# EAGLE design LEDboard (EAGLE 6.2)
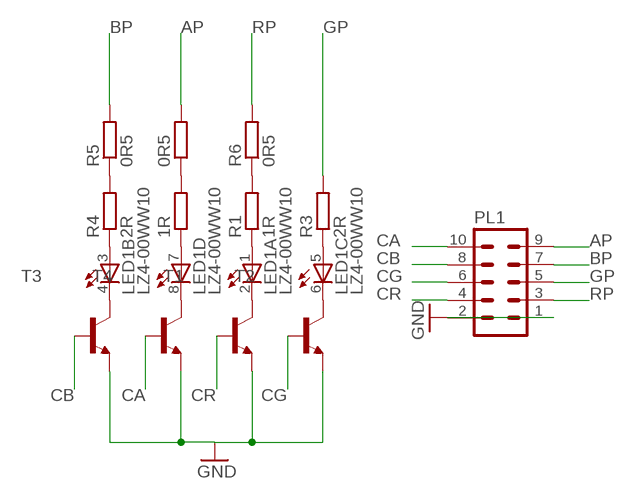
[diagram p0: schematic, sheet 1]

## Parts
0R5  R-EU_R0805  [R0805]
1R  R-EU_R1210  [R1210]
LED1  LZ4-00WW10  [LZ4-00WW10]
PL1  10V  [10V]
R1  1R  R-EU_R1210  [R1210]
R3  2R  R-EU_R2512  [R2512]
R4  2R  R-EU_R2512  [R2512]
R5  0R5  R-EU_R0805  [R0805]
R6  0R5  R-EU_R0805  [R0805]
T1  PZT2222A-NPN-SOT223  [SOT223]
T2  PZT2222A-NPN-SOT223  [SOT223]
T3  PZT2222A-NPN-SOT223  [SOT223]
T4  PZT2222A-NPN-SOT223  [SOT223]

## Nets
AP: 0R5.2 PL1.9
BP: PL1.7 R5.2
CA: PL1.10 T4.1(B)
CB: PL1.8 T3.1(B)
CG: PL1.6 T2.1(B)
CR: PL1.4 T1.1(B)
GND: PL1.1 PL1.2 T1.3(E) T2.3(E) T3.3(E) T4.3(E)
GP: PL1.5 R3.2
N$1: LED1.1(A:A) R1.1
N$2: 1R.1 LED1.7(D:A)
N$3: LED1.5(C:A) R3.1
N$4: LED1.3(B:A) R4.1
N$5: R4.2 R5.1
N$6: R1.2 R6.1
N$7: 0R5.1 1R.2
N$8: LED1.2(A:C) T1.4(C)
N$9: LED1.6(C:C) T2.4(C)
N$10: LED1.4(B:C) T3.4(C)
N$11: LED1.8(D:C) T4.4(C)
RP: PL1.3 R6.2

## Library data of the parts
0R5 1R R1 R3-R6 = resistor:R-EU_: RESISTOR, European symbol
LED1 = led1:LZ4-00WW10: High Luminous Efficacy 10W LED http://www.ledengin.com/products/10wLZ/LZ4-00WW10.pdf
PL1 = con-harting-v:10V: CONNECTOR; OC_FARNELL: unknown; OC_NEWARK: unknown
T1-T4 = transistor-neu-to92:*-NPN-: NPN Transistror

## Board
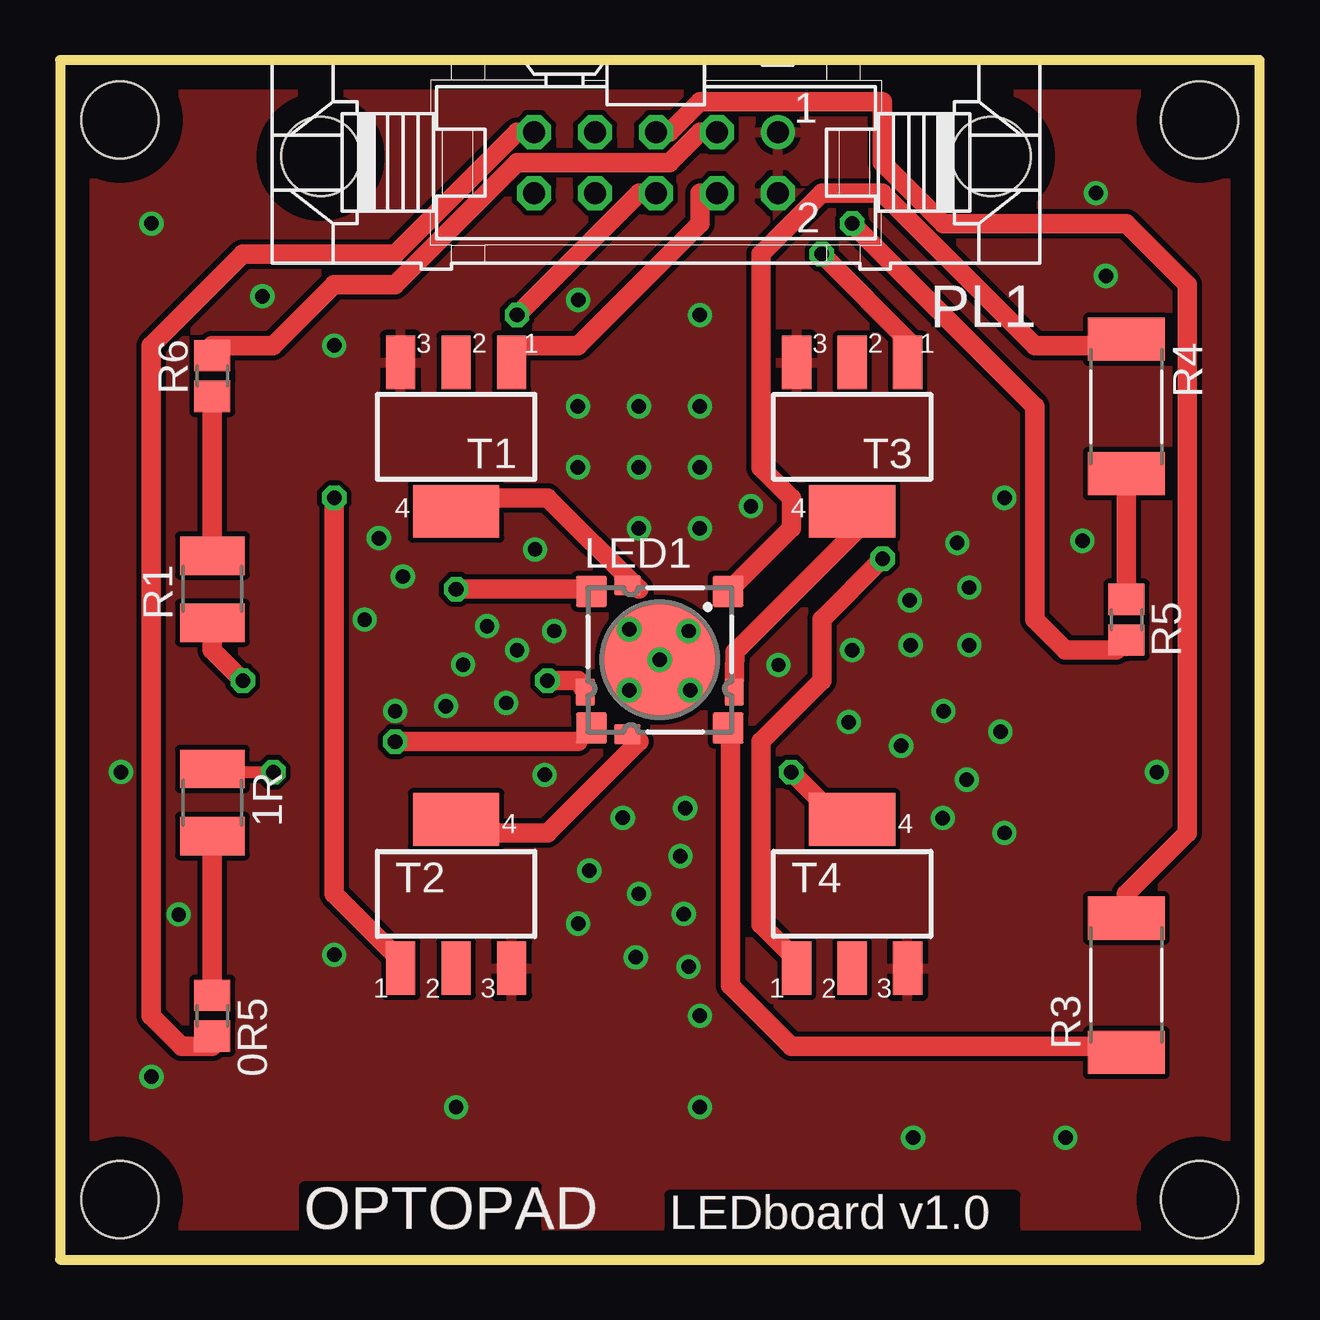
[diagram p1: board, top side]
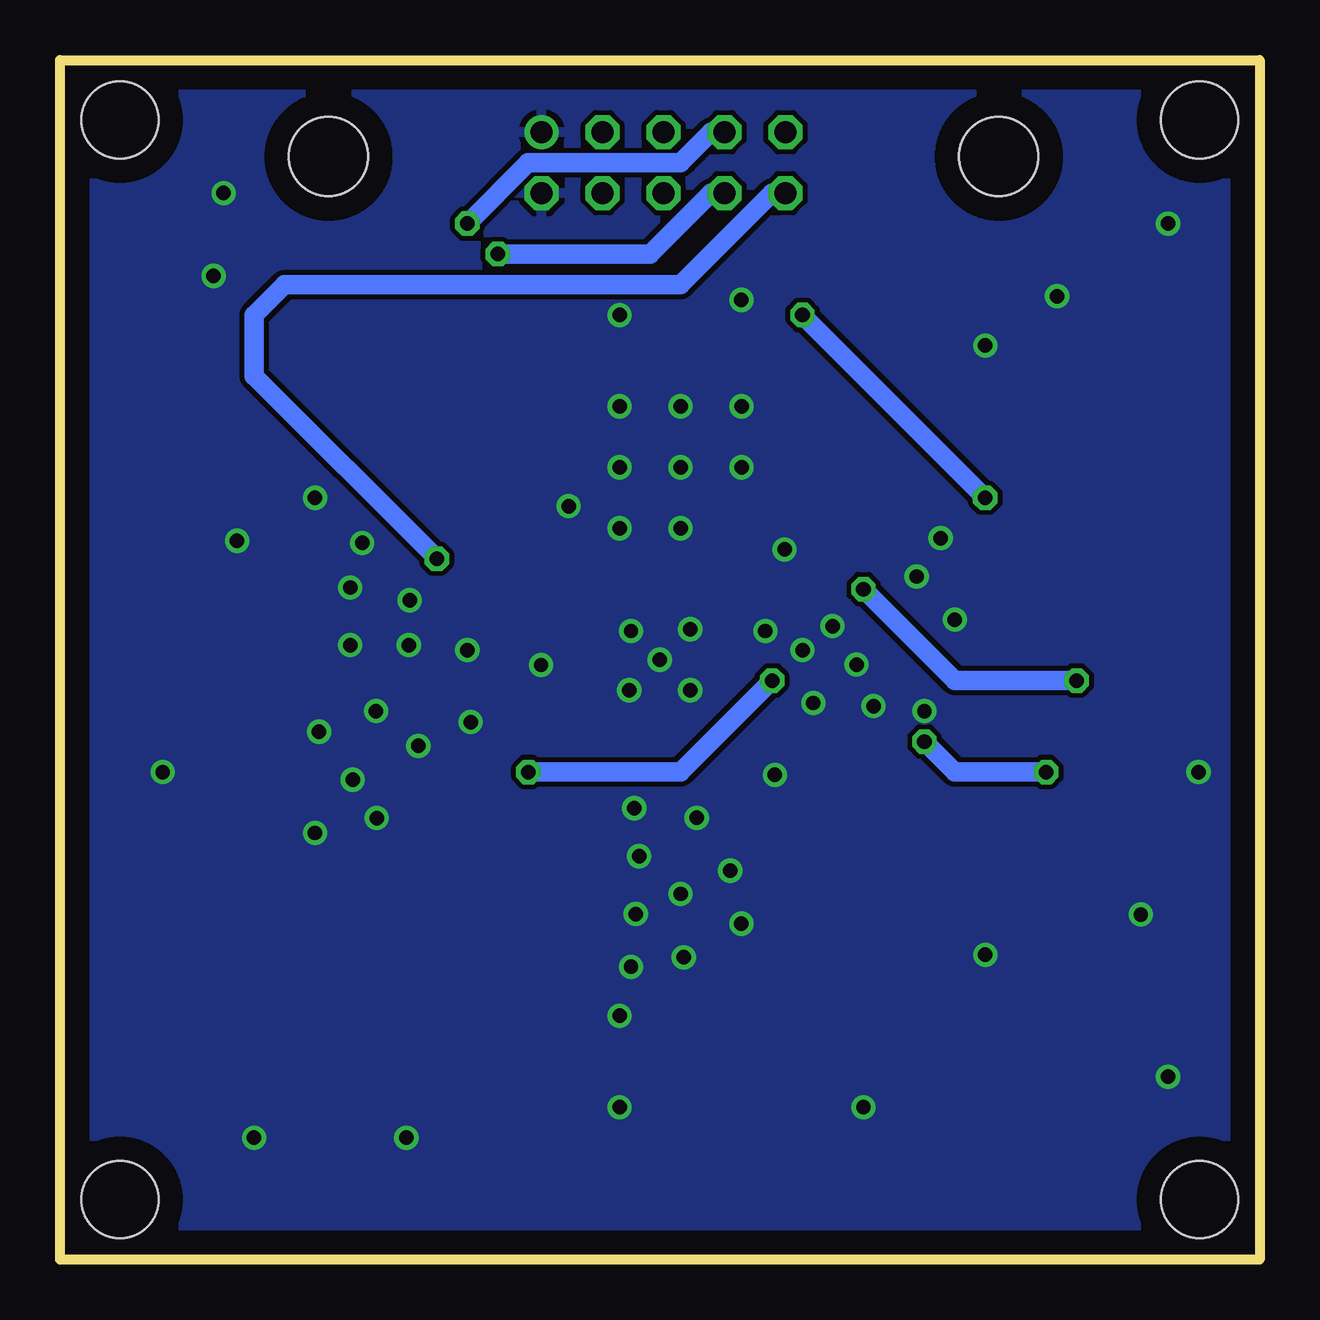
[diagram p2: board, bottom side, seen from below]

Size 50 x 50 mm. Coordinates in mm from the lower left corner, seen from the top.
Outline: 0,0 50,0 50,50 0,50 0,0
Copper layers (1*16): Top 0.035mm / dielectric 1.5mm / Bottom 0.035mm
Design rules: minimum track width 20mil, minimum drill 24mil, track to track 8mil, track to pad 8mil, pad to pad 8mil, via to via 8mil, smd to smd 8mil, copper to edge 40mil, drill to drill 8mil, minimum pad ring 10mil, minimum via ring 8mil, stop-mask expansion 4mil, vias tented up to drill 0mil, thermal gap 10mil
Holes 3.2 mm at 2.5,2.5 2.5,47.5 47.5,2.5 47.5,47.5

### Footprints (pad centres in the part's own frame; a part is rotated, then mirrored left to right if it is on the bottom)
R0805 = smd 1.3 x 1.5: 1 -0.85,0; 2 0.85,0
R1210 = smd 1.6 x 2.7: 1 -1.4,0; 2 1.4,0
LZ4-00WW10 = smd 1.3 x 1.3: 1 -2.85,2.85; 3 2.85,2.85; 5 2.85,-2.85; 7 -2.85,-2.85 | smd 1.1 x 0.8: 2 -1.35,3.1; 6 -1.35,-3.1 | smd 0.8 x 1.1: 4 3.1,-1.35; 8 -3.1,-1.35 | smd 5 x 5: 9 0,0
10V = drill 0.914: 1 -5.08,-1.27 | drill 0.914 octagon: 2 -5.08,1.27; 3 -2.54,-1.27; 4 -2.54,1.27; 5 0,-1.27; 6 0,1.27; 7 2.54,-1.27; 8 2.54,1.27; 9 5.08,-1.27; 10 5.08,1.27 | hole 3.302: 13.97,-0.254; -13.97,-0.254
R2512 = smd 1.8 x 3.2: 1 -2.8,0; 2 2.8,0
SOT223 = smd 1.219 x 2.235: 1 -2.311,-3.099; 2 0,-3.099; 3 2.311,-3.099 | smd 3.6 x 2.2: 4 0,3.099

### Placement (x,y rotation side)
0R5  6.35,10.16 270 top
1R  6.35,19.05 270 top
LED1  25,25 0 top
PL1  24.84,45.72 180 top
R1  6.35,27.94 90 top
R3  44.45,11.43 90 top
R4  44.45,35.56 270 top
R5  44.45,26.67 270 top
R6  6.35,36.83 90 top
T1  16.51,34.29 180 top
T2  16.51,15.24 0 top
T3  33.02,34.29 180 top
T4  33.02,15.24 0 top

### Tracks (layer width: path | path; a pad name or v marks a point on that pad's centre or on a via)
AP
  Top 0.508: 6.35,8.89 0R5.2 | 19.05,46.99 PL1.9
  Top 0.813: 19.05,46.99 13.97,41.91 7.62,41.91 3.81,38.1 3.81,10.16 5.08,8.89 6.35,8.89
BP  (via drill 0.61)
  Top 0.508: 44.45,25.4 R5.2
  Top 0.813: v33.02,43.18 40.64,35.56 40.64,26.67 41.91,25.4 44.03,25.4 R5.2
  Bottom 0.508: 22.86,46.99 PL1.7
  Bottom 0.813: v33.02,43.18 30.48,45.72 24.13,45.72 22.86,46.99
CA  (via drill 0.61)
  Top 0.508: 30.48,12.7 T4.1
  Top 0.813: 30.48,12.7 29.21,13.97 29.21,21.59 31.75,24.13 31.75,26.67 v34.29,29.21
  Bottom 0.813: v34.29,29.21 41.91,36.83 41.91,39.37 40.64,40.64 24.13,40.64 20.32,44.45 PL1.10
CB  (via drill 0.61)
  Top 0.508: 35.56,38.1 T3.1
  Top 0.813: v31.75,41.91 35.56,38.1
  Bottom 0.813: v31.75,41.91 25.4,41.91 22.86,44.45 PL1.8
CG  (via drill 0.61)
  Top 0.508: 13.97,12.7 T2.1
  Top 0.813: 13.97,12.7 11.43,15.24 v11.43,31.75 | v19.05,39.37 24.13,44.45 PL1.6
  Bottom 0.813: v19.05,39.37 v11.43,31.75
CR
  Top 0.508: 19.05,38.1 T1.1
  Top 0.813: PL1.4 26.67,44.45 26.67,43.18 21.59,38.1 19.05,38.1
GND  (via drill 0.6)
  other vias: 26.67,6.35 35.56,5.08 41.91,5.08 45.72,20.32 36.83,22.86 39.37,31.75 26.67,33.02 26.67,39.37 43.18,44.45 3.81,43.18 2.54,20.32 13.97,22.86 12.7,26.67 19.05,25.4 25,25 26.2,26.2 26.27,23.73 23.73,26.27 23.73,23.73 24.13,15.24 16.51,6.35 3.81,7.62 11.43,12.7 11.43,38.1 33.02,25.4 39.37,17.78 26.67,10.16 24.13,35.56 26.67,30.48 24.13,30.48 24.13,33.02 26.67,35.56 21.59,33.02 21.59,35.56 19.8,29.6 28.8,31.4 20.6,26.2 32.88,22.4 35.42,27.48 35.46,25.61 37.9,25.61 37.9,28.01 37.4,29.87 35.06,21.41 26.06,18.81 23.46,18.41 25.86,16.81 22.06,16.21 26,14.4 20.2,20.2 18.6,23.2 16.8,24.8 17.8,26.4 16.09,23.07 14.29,28.47 13.29,30.07 24,12.6 21.6,14 26.2,12.2 37.8,20 39.2,22 36.8,18.4 43.6,41 42.62,29.96 8.44,40.15 4.95,14.38 29.95,24.78 21.6,40
  pour Bottom: 0,50 50,50 50,0 0,0
  pour Top: 0,50 50,50 50,0 0,0
GP
  Top 0.508: 44.45,15.24 R3.2 44.45,13.97 | 25.4,46.99 PL1.5
  Top 0.813: 25.4,46.99 26.67,48.26 34.29,48.26 34.29,45.72 36.83,43.18 44.45,43.18 46.99,40.64 46.99,17.78 44.45,15.24
N$1  (via drill 0.61)
  Top 0.508: 21.59,27.94 LED1.1 | 6.35,26.67 R1.1
  Top 0.813: v16.51,27.94 21.59,27.94 | v7.62,24.13 6.35,25.4 R1.1
  Bottom 0.813: v16.51,27.94 12.7,24.13 v7.62,24.13
N$2  (via drill 0.61)
  Top 0.508: v8.89,20.32 6.35,20.32 1R.1 | 21.59,21.59 LED1.7
  Top 0.813: v13.97,21.59 21.59,21.59
  Bottom 0.813: v13.97,21.59 12.7,20.32 v8.89,20.32
N$3
  Top 0.508: 27.94,21.59 LED1.5 | 44.45,8.89 R3.1
  Top 0.813: 27.94,21.59 27.94,11.43 30.48,8.89 44.45,8.89
N$4
  Top 0.508: 44.45,38.1 R4.1
  Top 0.813: LED1.3 30.48,30.48 30.48,31.75 29.21,33.02 29.21,41.91 31.75,44.45 34.29,44.45 40.64,38.1 44.45,38.1
N$5
  Top 0.508: 44.45,33.02 R4.2
  Top 0.813: R4.2 R5.1
N$6
  Top 0.508: 6.35,29.21 R1.2
  Top 0.813: R1.2 R6.1
N$7
  Top 0.508: 6.35,17.78 1R.2
  Top 0.813: 1R.2 0R5.1
N$8
  Top 0.508: 24.13,27.94 LED1.2 | 16.51,31.75 T1.4
  Top 0.813: 24.13,27.94 20.32,31.75 16.51,31.75
N$9
  Top 0.508: 16.51,17.78 T2.4
  Top 0.813: 16.51,17.78 20.32,17.78 24.13,21.59 LED1.6
N$10
  Top 0.813: T3.4 33.22,30.41 28.14,25.33 LED1.4
N$11  (via drill 0.61)
  Top 0.508: 33.02,17.78 T4.4
  Top 0.813: v20.32,24.13 21.59,24.13 LED1.8 | 33.02,17.78 v30.48,20.32
  Bottom 0.813: v20.32,24.13 24.13,20.32 v30.48,20.32
RP
  Top 0.508: 6.35,38.1 R6.2 | 26.67,46.99 PL1.3
  Top 0.813: 26.67,46.99 25.4,45.72 19.05,45.72 13.97,40.64 11.43,40.64 8.89,38.1 6.35,38.1

### Text on the board
Top: OPTOPAD | LEDboard v1.0
tNames: OPTOPAD | LEDboard v1.0